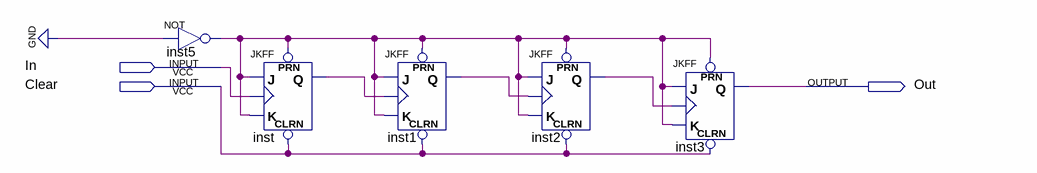
[diagram p0: schematic sheet]
// Quartus schematic Cont8jk.bdf as structural Verilog: 5 symbols, 3 pins
module Cont8jk (
  input  In,
  input  Clear,
  output Out
);

  wire inst1_q, inst2_q, inst5_out, inst_q;

  not inst5 (inst5_out, 1'b0);
  JKFF inst (.PRN(inst5_out), .CLRN(Clear), .K(inst5_out), .J(inst5_out), .CLK(In), .Q(inst_q));
  JKFF inst1 (.PRN(inst5_out), .CLRN(Clear), .K(inst5_out), .J(inst5_out), .CLK(inst_q), .Q(inst1_q));
  JKFF inst2 (.PRN(inst5_out), .CLRN(Clear), .K(inst5_out), .J(inst5_out), .CLK(inst1_q), .Q(inst2_q));
  JKFF inst3 (.PRN(inst5_out), .CLRN(Clear), .K(inst5_out), .J(inst5_out), .CLK(inst2_q), .Q(Out));
endmodule
